# EAGLE design communications_hub2 (EAGLE 9.2.2)
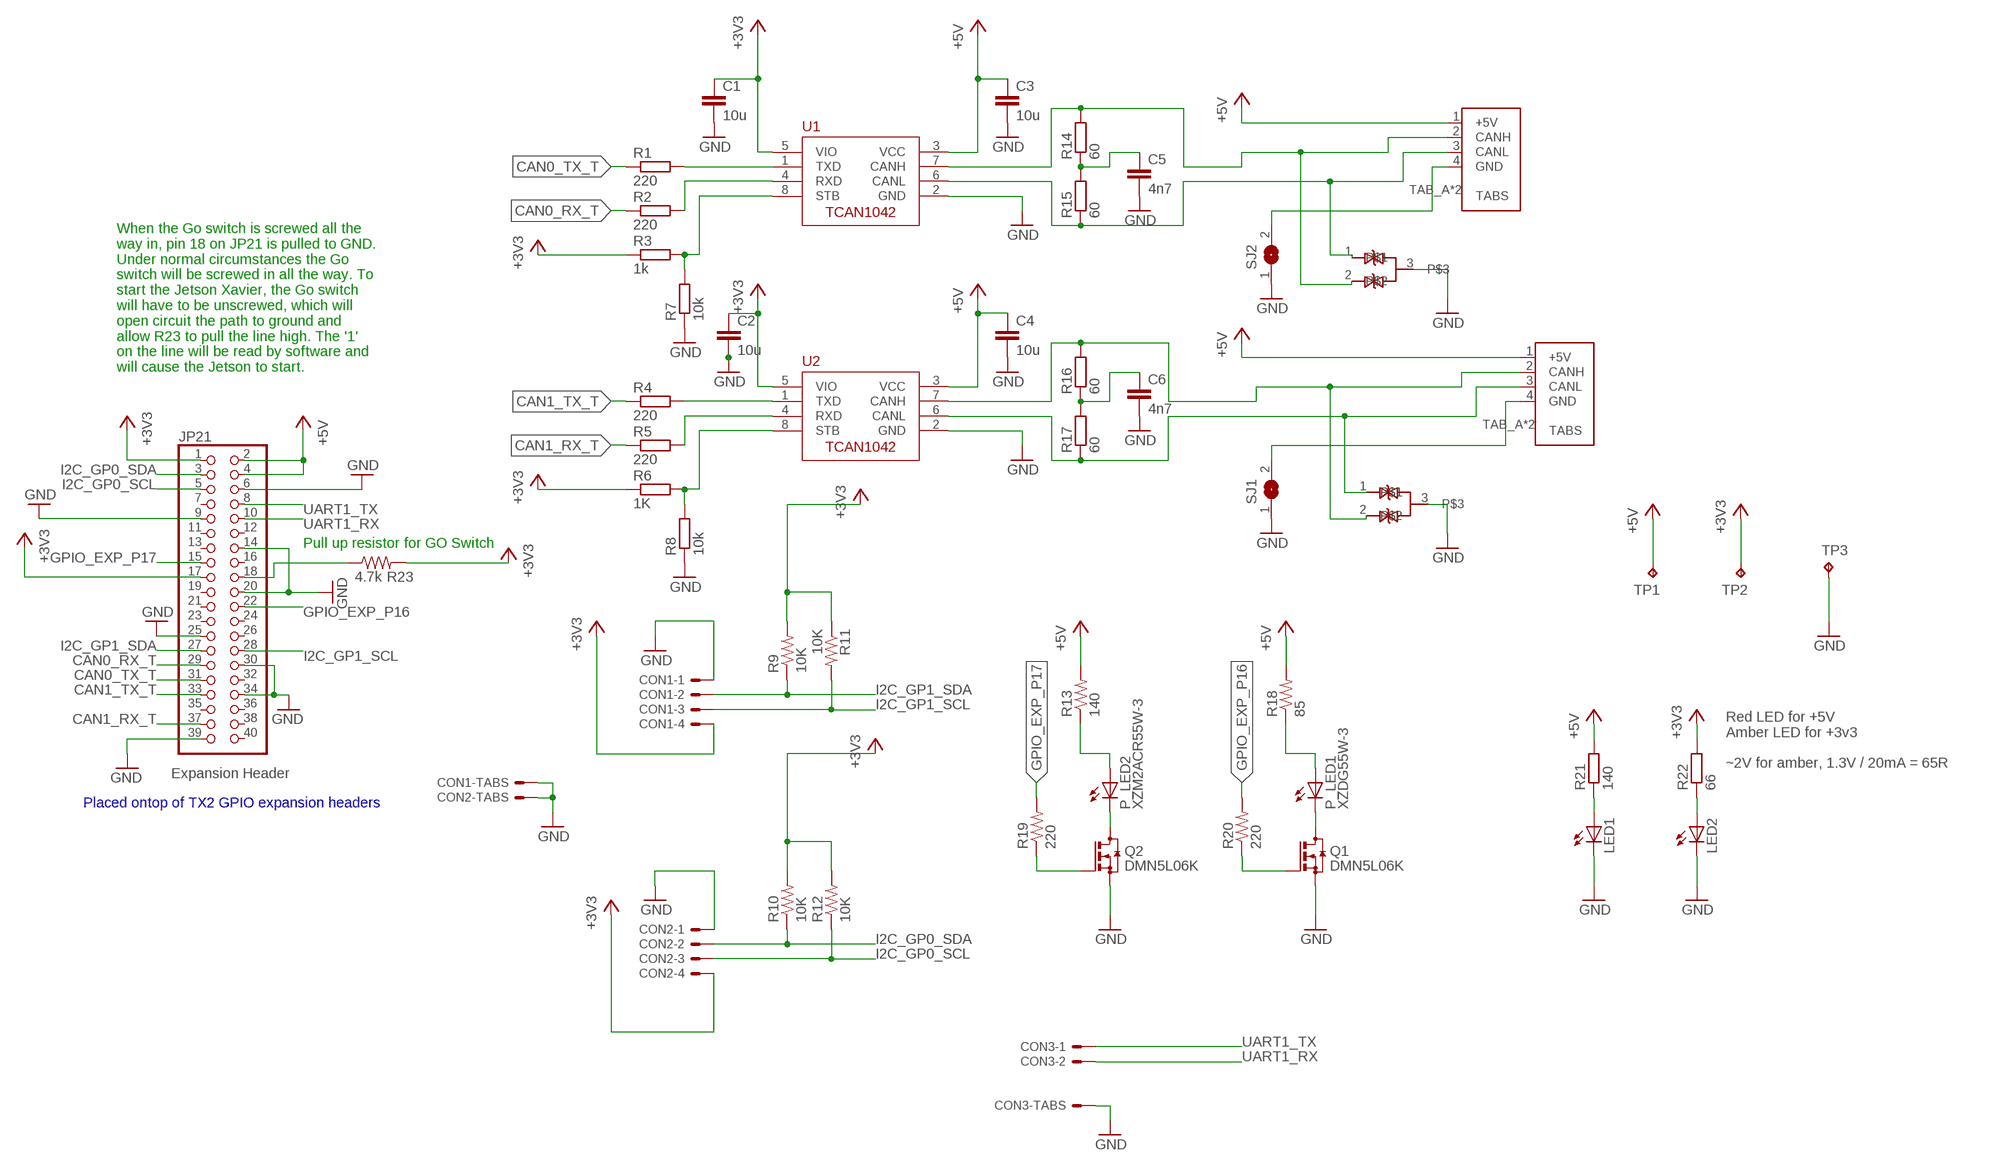
[diagram p0: schematic, sheet 1]

## Parts
C1  10u  C-EUC0805  [C0805]
C2  10u  C-EUC0805  [C0805]
C3  10u  C-EUC0805  [C0805]
C4  10u  C-EUC0805  [C0805]
C5  4n7  C-EUC0805  [C0805]
C6  4n7  C-EUC0805  [C0805]
CON1  SM04B-GHS-TB  [SM04B-GHS-TB]
CON2  SM04B-GHS-TB  [SM04B-GHS-TB]
CON3  SM02B-GHS-TB  [SM02B-GHS-TB]
CON6  UAVCAN_MICRO  [SM04B-GHS-TB]
CON7  UAVCAN_MICRO  [SM04B-GHS-TB]
JP21  PINHD-2X20  [2X20]
LED1  LEDSMT1206  [1206]
LED2  LEDSMT1206  [1206]
P_LED1  XZDG55W-3  LED_E  [LED_1206]
P_LED2  XZM2ACR55W-3  LED_E  [LED_1206]
Q1  DMN5L06K  BSS123  [SOT23]
Q2  DMN5L06K  BSS123  [SOT23]
R1  220  R-EU_R0805  [R0805]
R2  220  R-EU_R0805  [R0805]
R3  1k  R-EU_R0805  [R0805]
R4  220  R-EU_R0805  [R0805]
R5  220  R-EU_R0805  [R0805]
R6  1K  R-EU_R0805  [R0805]
R7  10k  R-EU_R0805  [R0805]
R8  10k  R-EU_R0805  [R0805]
R9  10K  R-US_M1206  [M1206]
R10  10K  R-US_M1206  [M1206]
R11  10K  R-US_M1206  [M1206]
R12  10K  R-US_M1206  [M1206]
R13  140  R-US_M1206  [M1206]
R14  60  R-EU_R1206  [R1206]
R15  60  R-EU_R1206  [R1206]
R16  60  R-EU_R1206  [R1206]
R17  60  R-EU_R1206  [R1206]
R18  85  R-US_M1206  [M1206]
R19  220  R-US_R0805  [R0805]
R20  220  R-US_R0805  [R0805]
R21  140  R-EU_R0805  [R0805]
R22  66  R-EU_R0805  [R0805]
R23  4.7k  R-US_R0603  [R0603]
SJ1  SJ  [SJ]
SJ2  SJ  [SJ]
TP1  TPB2,54  [B2,54]
TP2  TPB2,54  [B2,54]
TP3  TPB2,54  [B2,54]
U1  TCAN1042HVDR  [SO-8]
U2  TCAN1042HVDR  [SO-8]
U$4  NUP2105L  [SOT23]
U$5  NUP2105L  [SOT23]

## Nets
+3V3: C1.1 C2.1 CON1.P$4 CON2.P$4 JP21.1 JP21.17 R3.1 R6.1 R9.2 R10.2 R11.1 R12.2 R22.2 R23.2 TP2.TP U1.5(VIO) U2.5(VIO)
+5V: C3.1 C4.1 CON6.1(+5V) CON7.1(+5V) JP21.2 JP21.4 R13.2 R18.2 R21.2 TP1.TP U1.3(VCC) U2.3(VCC)
CAN0_RX_T: JP21.29 R2.1
CAN0_TX_T: JP21.31 R1.1
CAN1_RX_T: JP21.37 R5.1
CAN1_TX_T: JP21.33 R4.1
GND: C1.2 C2.2 C3.2 C4.2 C5.2 C6.2 CON1.P$1 CON1.P$5 CON1.P$6 CON2.P$1 CON2.P$5 CON2.P$6 CON3.P$3 CON3.P$4 JP21.6 JP21.9 JP21.14 JP21.20 JP21.25 JP21.30 JP21.34 JP21.39 LED1.C LED2.C Q1.2(S) Q2.2(S) R7.1 R8.1 SJ1.1 SJ2.1 TP3.TP U1.2(GND) U2.2(GND) U$4.3 U$5.3
GPIO_EXP_P16: JP21.22 R20.2
GPIO_EXP_P17: JP21.15 R19.2
I2C_GP0_SCL: CON2.P$3 JP21.5 R12.1
I2C_GP0_SDA: CON2.P$2 JP21.3 R10.1
I2C_GP1_SCL: CON1.P$3 JP21.28 R11.2
I2C_GP1_SDA: CON1.P$2 JP21.27 R9.1
N$1: JP21.18 R23.1
N$3: P_LED2.A R13.1
N$4: P_LED1.A R18.1
N$7: CON7.4(GND) SJ1.2
N$8: CON6.4(GND) SJ2.2
N$9: P_LED2.C Q2.3(D)
N$10: P_LED1.C Q1.3(D)
N$11: Q2.1(G) R19.1
N$12: Q1.1(G) R20.1
N$13: LED1.A R21.1
N$14: LED2.A R22.1
N$19: C5.1 R14.1 R15.2
N$20: C6.1 R16.1 R17.2
N$21: CON7.2(CANH) R16.2 U2.7(CANH) U$5.2
N$22: CON7.3(CANL) R17.1 U2.6(CANL) U$5.1
N$23: CON6.2(CANH) R14.2 U1.7(CANH) U$4.2
N$24: CON6.3(CANL) R15.1 U1.6(CANL) U$4.1
N$25: R1.2 U1.1(TXD)
N$26: R2.2 U1.4(RXD)
N$27: R3.2 R7.2 U1.8(STB)
N$28: R4.2 U2.1(TXD)
N$29: R5.2 U2.4(RXD)
N$30: R6.2 R8.2 U2.8(STB)
UART1_RX: CON3.P$2 JP21.10
UART1_TX: CON3.P$1 JP21.8
Unconnected: CON6.TAB_A(TABS) CON6.TAB_B(TABS) CON7.TAB_A(TABS) CON7.TAB_B(TABS) JP21.7 JP21.11 JP21.12 JP21.13 JP21.16 JP21.19 JP21.21 JP21.23 JP21.24 JP21.26 JP21.32 JP21.35 JP21.36 JP21.38 JP21.40

## Notes on the sheet
- When the Go switch is screwed all the
   way in, pin 18 on JP21 is pulled to GND.
   Under normal circumstances the Go
   switch will be screwed in all the way. To
   start the Jetson Xavier, the Go switch
   will have to be unscrewed, which will
   open circuit the path to ground and
   allow R23 to pull the line high. The '1'
   on the line will be read by software and
   will cause the Jetson to start.
- Pull up resistor for GO Switch
- Expansion Header
- Red LED for +5V
  Amber LED for +3v3
  
  ~2V for amber, 1.3V / 20mA = 65R
- Placed ontop of TX2 GPIO expansion headers

## Library data of the parts
C1-C6 = resistor:C-EU: CAPACITOR, European symbol
CON1 CON2 = ARVP:SM04B-GHS-TB
CON3 = ARVP:SM02B-GHS-TB
CON6 CON7 = SPEAR-general:UAVCAN_MICRO: CAN Bus Standard Connector
JP21 = commhub:PINHD-2X20: PIN HEADER
LED1 LED2 = led:LED: LED OSRAM: - CHIPLED LG R971, LG N971, LY N971, LG Q971, LY Q971, LO R971, LY R971 LH N974, LH R974 LS Q976, LO Q976, LY Q976 LO Q996 - Hyper CHIPLED LW Q18S LB Q993, LB Q99A, LB R99A - SideLED LS A670, LO A670, LY A670, LG A670, LP A670 LB A673, LV A673, LT A673, LW A673 LH A674 LY A675 LS A676, LA A676, LO A676, LY A676, LW A676 LS A679, LY A679, LG A679 - Hyper Micro SIDELED® LS Y876, LA Y876, LO Y876, LY Y876 LT Y87S - SmartLED LW L88C, LW L88S LB L89C, LB L89S, LG L890 LS L89K, LO L89K, LY L89K LS L896, LA L896, LO L896, LY L896 - TOPLED LS T670, LO T670, LY T670, LG T670, LP T670 LSG T670, LSP T670, LSY T670, LOP T670, LYG T670 LG T671, LOG T671, LSG T671 LB T673, LV T673, LT T673, LW T673 LH T674 LS T676, LA T676, LO T676, LY T676, LB T676, LH T676, LSB T676, LW T676 LB T67C, LV T67C, LT T67C, LS T67K, LO T67K, LY T67K, LW E67C LS E67B, LA E67B, LO E67B, LY E67B, LB E67C, LV E67C, LT E67C LW T67C LS T679, LY T679, LG T679 LS T770, LO T770, LY T770, LG T770, LP T770 LB T773, LV T773, LT T773, LW T773 LH T774 LS E675, LA E675, LY E675, LS T675 LS T776, LA T776, LO T776, LY T776, LB T776 LHGB T686 LT T68C, LB T68C - Hyper Mini TOPLED® LB M676 - Mini TOPLED Santana® LG M470 LS M47K, LO M47K, LY M47K Source: http://www.osram.convergy.de LUXEON: - LUMILED® LXK2-PW12-R00, LXK2-PW12-S00, LXK2-PW14-U00, LXK2-PW14-V00 LXK2-PM12-R00, LXK2-PM12-S00, LXK2-PM14-U00 LXK2-PE12-Q00, LXK2-PE12-R00, LXK2-PE12-S00, LXK2-PE14-T00, LXK2-PE14-U00 LXK2-PB12-K00, LXK2-PB12-L00, LXK2-PB12-M00, LXK2-PB14-N00, LXK2-PB14-P00, LXK2-PB14-Q00 LXK2-PR12-L00, LXK2-PR12-M00, LXK2-PR14-Q00, LXK2-PR14-R00 LXK2-PD12-Q00, LXK2-PD12-R00, LXK2-PD12-S00 LXK2-PH12-R00, LXK2-PH12-S00 LXK2-PL12-P00, LXK2-PL12-Q00, LXK2-PL12-R00 Source: www.luxeon.com KINGBRIGHT: KA-3528ASYC Source: www.kingbright.com
P_LED1 P_LED2 = eagle-ltspice:LED_E: LED Source: http://www.osram.convergy.de Source: www.luxeon.com Source: www.kingbright.com; SPICEMODEL: NONE; SPICEPREFIX: D; SPICETYPE: diode
Q1 Q2 = transistor-small-signal:BSS123: N-CHANNEL MOS FET
R1-R8 R14-R17 R21 R22 = resistor:R-EU_: RESISTOR, European symbol
R9-R13 R18 = resistor:R-US_: RESISTOR, American symbol
R19 R20 = rcl:R-US_: RESISTOR, American symbol
R23 = audio amplifier example:R-US_: RESISTOR, American symbol
SJ1 SJ2 = jumper:SJ: SMD solder JUMPER
TP1-TP3 = testpad:TP: Test pad
U1 U2 = ARVP:TCAN1042HVDR
U$4 U$5 = ARVP:NUP2105L

## Board
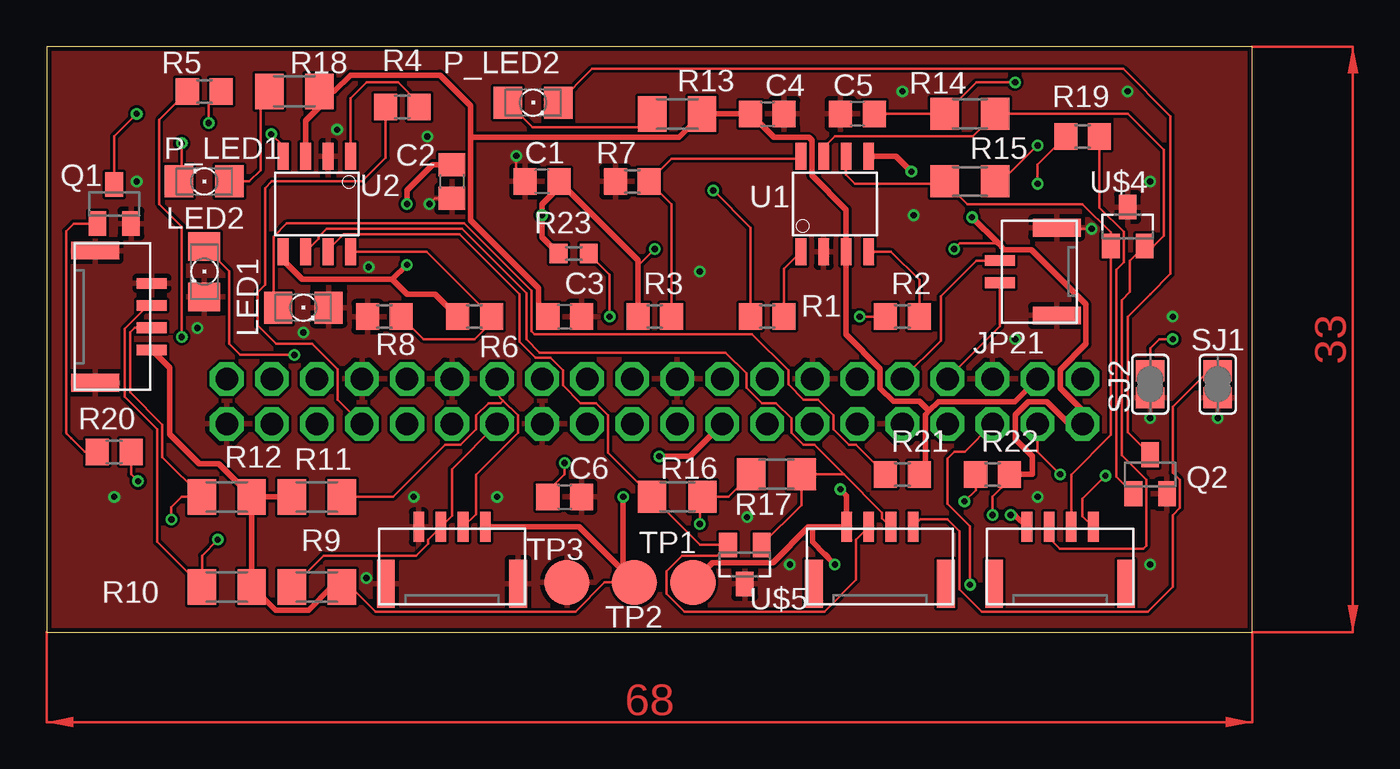
[diagram p1: board, top side]
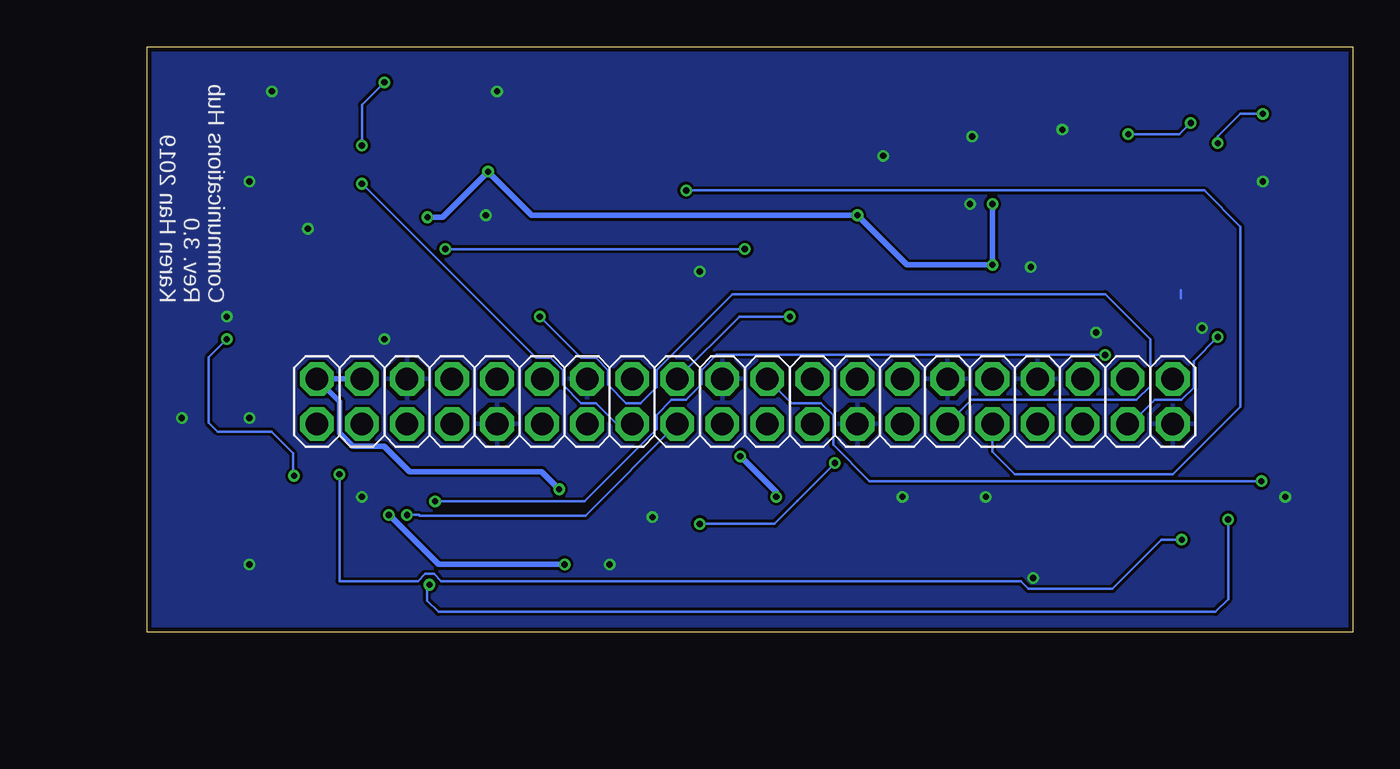
[diagram p2: board, bottom side, seen from below]

Size 68 x 33 mm. Coordinates in mm from the lower left corner, seen from the top.
Outline: 0,0 68,0 68,33 0,33 0,0
Copper layers (1*16): Top 0.035mm / dielectric 1.5mm / Bottom 0.035mm
Design rules "JLCPCB2Layer": minimum track width 6mil, minimum drill 10mil, track to track 6mil, track to pad 6mil, pad to pad 6mil, via to via 6mil, smd to smd 0mil, copper to edge 10mil, drill to drill 10mil, minimum pad ring 6mil, minimum via ring 6mil, stop-mask expansion 2mil, vias tented up to drill 100mil, thermal gap 10mil

### Footprints (pad centres in the part's own frame; a part is rotated, then mirrored left to right if it is on the bottom)
C0805 = smd 1.3 x 1.5: 1 -0.95,0; 2 0.95,0
SM04B-GHS-TB = smd 0.6 x 1.7: P$1 -1.875,0.85; P$2 -0.625,0.85; P$3 0.625,0.85; P$4 1.875,0.85 | smd 1 x 2.7: P$5 -3.725,-2.35; P$6 3.725,-2.35
SM02B-GHS-TB = smd 0.6 x 1.7: P$1 -0.625,0.85; P$2 0.625,0.85 | smd 1 x 2.7: P$3 -2.475,-2.35; P$4 2.475,-2.35
SM04B-GHS-TB' = smd 0.6 x 1.7: 1 -1.875,0.85; 2 -0.625,0.85; 3 0.625,0.85; 4 1.875,0.85 | smd 1 x 2.7: TAB_A -3.725,-2.35; TAB_B 3.725,-2.35
2X20 = drill 1.27 octagon: 1 -24.13,-1.27; 2 -24.13,1.27; 3 -21.59,-1.27; 4 -21.59,1.27; 5 -19.05,-1.27; 6 -19.05,1.27; 7 -16.51,-1.27; 8 -16.51,1.27; 9 -13.97,-1.27; 10 -13.97,1.27; 11 -11.43,-1.27; 12 -11.43,1.27; 13 -8.89,-1.27; 14 -8.89,1.27; 15 -6.35,-1.27; 16 -6.35,1.27; 17 -3.81,-1.27; 18 -3.81,1.27; 19 -1.27,-1.27; 20 -1.27,1.27; 21 1.27,-1.27; 22 1.27,1.27; 23 3.81,-1.27; 24 3.81,1.27; 25 6.35,-1.27; 26 6.35,1.27; 27 8.89,-1.27; 28 8.89,1.27; 29 11.43,-1.27; 30 11.43,1.27; 31 13.97,-1.27; 32 13.97,1.27; 33 16.51,-1.27; 34 16.51,1.27; 35 19.05,-1.27; 36 19.05,1.27; 37 21.59,-1.27; 38 21.59,1.27; 39 24.13,-1.27; 40 24.13,1.27
1206 = smd 1.6 x 1.803: A -1.422,0; C 1.422,0
LED_1206 = smd 1.6 x 1.803: A -1.422,0; C 1.422,0
SOT23 = smd 1 x 1.4: 1 -0.95,-1.1; 2 0.95,-1.1; 3 0,1.1
R0805 = smd 1.3 x 1.5: 1 -0.95,0; 2 0.95,0
M1206 = smd 1.6 x 2: 1 -1.4,0; 2 1.4,0
R1206 = smd 1.6 x 1.803: 1 -1.422,0; 2 1.422,0
R0603 = smd 1 x 1.1: 1 -0.85,0; 2 0.85,0
SJ = smd 1.168 x 1.6: 1 -0.762,0; 2 0.762,0
B2,54 = smd 2.54 x 2.54: TP 0,0
SO-8 = smd 1.524 x 0.61: 1 -2.692,1.905; 2 -2.692,0.635; 3 -2.692,-0.635; 4 -2.692,-1.905; 5 2.692,-1.905; 6 2.692,-0.635; 7 2.692,0.635; 8 2.692,1.905

### Placement (x,y rotation side)
C1  27.94,25.4 180 top
C2  22.86,25.4 270 top
C3  29.21,17.78 0 top
C4  40.64,29.21 0 top
C5  45.72,29.21 180 top
C6  29.21,7.62 0 top
CON1  22.86,5.08 0 top
CON2  5.08,17.78 270 top
CON3  54.61,20.32 90 top
CON6  UAVCAN_MICRO  [SM04B-GHS-TB']  57.15,5.08 0 top
CON7  UAVCAN_MICRO  [SM04B-GHS-TB']  46.99,5.08 0 top
JP21  34.29,13 0 bottom
LED1  14.48,18.29 0 top
LED2  8.89,20.32 270 top
P_LED1  8.89,25.4 180 top
P_LED2  27.43,29.84 0 top
Q1  3.81,24.13 0 top
Q2  62.23,8.89 0 top
R1  40.64,17.78 0 top
R2  48.26,17.78 0 top
R3  34.29,17.78 0 top
R4  20.07,29.59 0 top
R5  8.89,30.48 0 top
R6  24.13,17.78 0 top
R7  33.02,25.4 0 top
R8  19.05,17.78 0 top
R9  15.24,2.54 0 top
R10  10.16,2.54 0 top
R11  15.24,7.62 0 top
R12  10.16,7.62 0 top
R13  35.56,29.21 0 top
R14  52.07,29.21 0 top
R15  52.07,25.4 0 top
R16  35.56,7.62 180 top
R17  41.15,8.89 180 top
R18  13.97,30.48 0 top
R19  58.42,27.94 180 top
R20  3.81,10.16 0 top
R21  48.26,8.89 0 top
R22  53.34,8.89 0 top
R23  29.72,21.34 180 top
SJ1  66.04,13.97 90 top
SJ2  62.23,13.97 90 top
TP1  36.45,2.79 0 top
TP2  33.15,2.79 0 top
TP3  29.34,2.79 0 top
U1  44.45,24.13 90 top
U2  15.24,24.13 270 top
U$4  60.96,22.86 0 top
U$5  39.37,3.81 180 top

### Tracks (layer width: path | path; a pad name or v marks a point on that pad's centre or on a via)
+3V3  (via drill 0.35)
  Top 0.152: R3.1 33.34,20.64 v34.29,21.59 | v51.18,21.59 51.5,21.91 53.66,21.91 | R22.2 54.29,8.57 53.34,7.62 v53.34,6.6 | R9.2 17.15,2.54 18.54,1.15 29.81,1.15 31.46,2.79 TP2.TP
  Top 0.305: U2.5 13.34,20.95 14.41,19.88 19.49,19.88 | CON2.P$4 6.93,14.9 6.93,11.15 8.61,9.47 9.71,9.47 R12.2 | R12.2 R11.1 | CON1.P$4 30.01,5.93 TP2.TP 32.51,3.43 v32.51,7.62 | R12.2 R10.2 11.61,2.54 12.91,1.24 14.77,1.24 16.07,2.54 R9.2 | R3.1 33.34,20.95 C1.1 28.89,25.08 27.94,24.13 v27.94,23.5 27.94,22.26 R23.2 | R22.2 55.58,8.89 55.58,9.92 54.62,10.88 54.62,12.25 55.36,12.99 56.4,12.99 57.66,11.73 JP21.1 58.42,12.49 57.16,13.75 57.16,14.79 58.62,16.24 58.62,18.47 55.54,21.55 54.02,21.55 53.66,21.91 v52.19,23.38 | JP21.17 36.28,9.91 v34.54,9.91 | v20.32,24.13 20.32,24.89 21.78,26.35 C2.1 | v20.32,20.7 19.49,19.88 | 19.49,19.88 | U1.5 47.9,26.82 v48.77,25.96 | 19.49,19.88 20.32,19.05 21.91,19.05 R6.1
  Bottom 0.152: v34.29,21.59 v51.18,21.59 | v53.34,6.6 52.67,6.6 52.62,6.56 43.27,6.56 JP21.17
  Bottom 0.305: v20.32,24.13 v20.32,20.7 25.15,20.7 v27.94,23.5 31.75,23.5 46.31,23.5 v48.77,25.96 51.34,23.38 v52.19,23.38 | v34.54,9.91 32.51,7.87 v32.51,7.62
+5V  (via drill 0.35)
  Top 0.305: U2.3 14.61,28.83 15.37,29.59 R18.2 16.23,30.48 17.14,31.4 22.18,31.4 23.91,29.67 23.91,27.91 | TP1.TP 37.56,3.9 40.95,3.9 42.97,5.93 43.18,5.93 | 43.18,5.93 CON7.1 45.12,7.69 v44.76,8.05 | C3.1 27.74,18.3 27.74,19.38 23.91,23.21 23.91,27.91 | 49.76,12.47 49.54,12.25 49.54,9.22 R21.2 | 49.76,12.47 50.28,12.99 54.6,12.99 JP21.4 | CON6.1 54.61,6.59 54.61,6.6 v54.36,6.6 | 43.18,5.93 43.18,5.08 43.88,4.38 43.89,4.38 44.07,4.21 44.07,4.19 v44.45,3.81 | 23.91,27.91 35.66,27.91 R13.2 C4.1 41.01,27.89 42.98,27.89 43.16,27.71 43.16,25.75 45.09,23.82 U1.3 45.09,16.77 47,14.86 47,13.75 47.74,13.01 49.22,13.01 49.76,12.47
  Bottom 0.305: v54.36,6.6 51.56,3.81 v44.45,3.81 | JP21.4 JP21.2 57.14,12.99 57.14,11.21 56.4,10.47 54.62,10.47 53.19,9.04 45.75,9.04 v44.76,8.05
CAN0_RX_T  (via drill 0.35)
  Top 0.152: R2.1 v45.85,17.78
  Bottom 0.152: v45.85,17.78 43.52,15.45 42.69,15.45 42,14.76 42,13.93 40.98,12.91 40.16,12.91 39.28,13.79 39.28,14.76 34.99,19.05 13.97,19.05 11.43,16.51 11.43,13.87 12.21,13.09 21.5,13.09 JP21.29
CAN0_TX_T  (via drill 0.35)
  Top 0.152: R1.1 39.69,22.79 v37.59,24.89
  Bottom 0.152: v37.59,24.89 8.38,24.89 6.35,22.86 6.35,12.7 10.16,8.89 19.05,8.89 20.32,10.16 JP21.31
CAN1_RX_T  (via drill 0.35)
  Top 0.152: R5.1 6.35,28.89 6.35,24.13 7.62,22.86 v7.62,16.64
  Bottom 0.152: JP21.37 12.53,11.73 11.17,13.09 9.67,13.09 8.98,13.78 8.98,15.28 v7.62,16.64
CAN1_TX_T
  Top 0.152: R4.1 19.12,26.74 17.78,25.4 12.7,25.4 12.32,25.02 12.32,19.58 11.9,19.16 11.9,17.29 12.94,16.26 14.99,16.26 16.42,14.82 16.42,13.09 JP21.33
GND  (via drill 0.35)
  Top 0.152: SJ1.1 v66.04,12.06 | v58.93,22.73 57.02,22.73 CON3.P$4 | C2.2 22.86,24.46 | C2.2 22.8,24.39 22.86,24.34 22.86,24.08 | v26.48,26.84 26.48,25.91 C1.2 | C2.2 21.91,24.45 v21.59,24.13
  Bottom 0.152: 9.71,18.82 9.71,19.28
  other vias: 54.61,16.51 63.5,17.78 36.83,20.32 62.23,3.81 55.88,7.62 5.08,25.4 18.16,20.57 41.91,3.81 25.4,7.62 20.7,7.62 3.81,7.62 16.38,28.32 48.9,23.5 60.96,30.48 48.26,30.48 18.03,3.05 39.5,6.48 62.23,25.4 21.46,27.94 8.51,17.14 14.48,16.89 62.23,12.06
  pour Top: 0,33.02 0,0 67.94,0 67.94,32.89 0.13,32.89
  pour Bottom: 0,33.02 0,0 67.94,0 67.94,33.02
GPIO_EXP_P16  (via drill 0.35)
  Top 0.152: R20.2 4.76,8.89 5.14,8.51 v5.16,8.51
  Bottom 0.152: v5.16,8.51 27.26,8.51 29.3,10.55 29.3,12.22 29.99,12.91 31.66,12.91 JP21.22
GPIO_EXP_P17  (via drill 0.35)
  Top 0.152: R19.2 55.88,26.35 v55.88,25.27
  Bottom 0.152: v55.88,25.27 46.06,15.45 45.23,15.45 44.54,14.76 44.54,13.93 43.52,12.91 42.69,12.91 41.51,11.73 JP21.15
I2C_GP0_SCL  (via drill 0.35)
  Top 0.152: CON2.P$3 4.96,17.16 4.7,16.89 4.7,13.51 6.53,11.68 6.53,9.85 R12.1 7.62,7.62 7.03,7.03 v7.03,6.35 | v52.07,2.67 52.07,5.97 50.8,7.24 50.8,9.78 51.18,10.16 51.77,10.16 JP21.5
  Bottom 0.152: v52.07,2.67 52.2,2.67 52.2,1.78 51.56,1.14 7.75,1.14 7.03,1.86 v7.03,6.35
I2C_GP0_SDA  (via drill 0.35)
  Top 0.152: CON2.P$2 5.71,18.41 5.71,18.4 4.39,17.09 4.39,13.26 6.22,11.43 6.22,5.08 R10.1 8.76,4.32 v9.65,5.21 | v57.15,8.89 55.88,10.16 JP21.3
  Bottom 0.152: v57.15,8.89 57.15,2.87 52.73,2.87 52.32,3.27 51.82,3.27 51.41,2.87 18.71,2.87 18.29,2.44 13.56,2.44 10.79,5.21 v9.65,5.21
I2C_GP1_SCL
  Top 0.152: CON1.P$3 24.21,6.65 24.21,8.87 26.58,11.24 26.58,12.22 25.75,13.05 | JP21.28 25.4,13.4 25.75,13.05 | 25.75,13.05 25.61,12.91 24.91,12.91 24.22,12.22 24.22,11.42 23.35,10.55 22.46,10.55 19.53,7.62 R11.2
I2C_GP1_SDA
  Top 0.152: JP21.27 22.86,9.19 22.86,6.55 CON1.P$2 21.51,5.21 21.51,4.99 20.84,4.31 15.61,4.31 R9.1
N$1  (via drill 0.35)
  Top 0.152: R23.1 31.75,20.15 v31.75,17.78
  Bottom 0.152: v31.75,17.78 34.59,17.78 JP21.18
N$3
  Top 0.152: P_LED2.A 27.41,28.45 33.4,28.45 R13.1
N$4
  Top 0.152: R18.1 12.06,29.97 12.06,26.03 11.43,25.4 P_LED1.A
N$7
  Top 0.152: SJ1.2 65.53,14.73 63.5,12.7 63.5,8.99 63.91,8.59 63.91,7 63.5,6.59 63.5,2.54 62.11,1.15 52.73,1.15 51.46,2.42 51.46,5.69 50.8,6.35 49.28,6.35 CON7.4
N$8  (via drill 0.35)
  Top 0.152: CON6.4 58.42,6.54 58.42,7.53 v59.71,8.81 | v63.5,16.51 62.74,16.51 62.23,16 SJ2.2
  Bottom 0.152: v63.5,16.51 64.52,15.49 64.52,11.81 64.01,11.3 60.98,11.3 59.77,10.08 59.77,8.87 v59.71,8.81
N$9
  Top 0.152: P_LED2.C 30.76,31.75 60.71,31.75 63.37,29.08 63.37,20.19 62.23,19.05 60.96,17.78 60.96,11.26 Q2.3
N$10  (via drill 0.35)
  Top 0.152: Q1.3 3.81,27.94 v5.08,29.21 | v7.62,27.56 7.62,25.55 P_LED1.C
  Bottom 0.152: v5.08,29.21 6.35,29.21 7.62,27.94 v7.62,27.56
N$11
  Top 0.152: R19.1 59.37,23.92 60.74,22.55 60.74,20.86 60.31,20.44 60.31,8.76 Q2.1
N$12
  Top 0.152: R20.1 2.16,10.16 1.4,10.92 1.14,11.18 1.09,11.23 1.09,22.6 1.52,23.03 Q1.1
N$13
  Top 0.152: R21.1 45.65,10.55 45.23,10.55 44.36,11.42 44.36,12.22 43.49,13.09 42.69,13.09 41.82,13.96 41.82,14.76 39.78,16.8 27.52,16.8 27.36,16.96 27.36,19.23 23.54,23.04 13.54,23.04 12.8,22.29 12.8,18.54 LED1.A
N$14  (via drill 0.35)
  Top 0.152: LED2.A 10.29,20.34 10.29,16.26 10.92,15.62 v13.97,15.62 | R22.1 52.39,8 v51.76,7.37
  Bottom 0.152: v51.76,7.37 43.33,7.37 39.28,11.42 39.28,12.22 38.41,13.09 37.61,13.09 36.74,13.96 36.74,14.76 35.88,15.62 v13.97,15.62
N$19  (via drill 0.35)
  Top 0.152: C5.1 R14.1 52.43,30.99 v54.61,30.99 | v55.88,27.43 53.85,25.4 R15.2
  Bottom 0.152: v54.61,30.99 55.88,29.72 v55.88,27.43
N$20  (via drill 0.35)
  Top 0.152: R17.2 38.46,7.62 R16.1 36.83,7.47 v36.83,6.1 | C6.1 28.26,7.94 29.21,8.89 v29.21,9.53
  Bottom 0.152: v29.21,9.53 31.32,7.41 31.32,7.39 32.62,6.1 v36.83,6.1
N$21
  Top 0.152: U2.7 15.88,21.56 16.75,22.43 23.29,22.43 26.67,19.05 26.67,16.36 27.58,15.45 28.43,15.45 29.12,14.76 29.12,13.91 30.12,12.91 30.97,12.91 31.66,12.22 31.66,10.1 R16.2 36.85,4.91 U$5.2 37.8,4.29 35.83,4.29 34.95,3.42 34.95,2.17 35.97,1.15 43.86,1.15 45.64,2.94 45.64,5.21 CON7.2
N$22
  Top 0.152: U2.6 15.34,22.17 15.34,22.29 15.78,22.73 23.42,22.73 27.05,19.1 27.05,16.51 27.8,15.76 38.28,15.76 39.46,14.58 39.46,13.78 40.33,12.91 41.13,12.91 42,12.04 42,11.24 42.69,10.55 43.3,10.55 44.96,8.89 | CON7.3 47.12,6.43 47.12,6.73 44.96,8.89 | 44.96,8.89 R17.1 42.57,7.16 U$5.1
N$23
  Top 0.152: U1.7 43.81,27.3 44.45,27.94 52.22,27.94 R14.2 60.96,29.21 62.99,27.18 62.99,22.35 62.4,21.76 U$4.2 61.09,20.94 61.09,19.18 60.62,18.71 60.62,9.97 62.01,8.59 62.01,4.86 61.85,4.7 57.15,4.7 56.52,5.32 CON6.2
N$24
  Top 0.152: U1.6 45.09,25.78 45.59,25.27 50.52,25.27 R15.1 51.92,24.13 58.42,24.13 60.01,22.54 U$4.1 60.01,11.12 57.77,8.88 CON6.3
N$25
  Top 0.152: R1.2 41.59,20.48 U1.1
N$26
  Top 0.152: R2.2 49.21,19.85 47.62,21.44 U1.4
N$27
  Top 0.152: R3.2 35.24,24.13 R7.2 35.24,26.67 42.39,26.67 U1.8
N$28
  Top 0.152: U2.1 17.14,30.1 18.03,30.99 19.81,30.99 21.02,29.78 R4.2
N$29  (via drill 0.35)
  Top 0.152: R5.2 9.14,29.78 v9.14,28.7 | v12.67,28.07 13.34,27.4 U2.4
  Bottom 0.152: v9.14,28.7 9.78,28.07 v12.67,28.07
N$30
  Top 0.152: U2.8 21.42,21.44 R6.2 25.08,17.46 24.13,16.51 21.27,16.51 R8.2
UART1_RX
  Top 0.152: CON3.P$2 52.44,20.95 50.42,18.92 50.42,16.43 JP21.10
UART1_TX
  Top 0.152: CON3.P$1 53.76,17.23 JP21.8
(copper drawn outside any net)
  shapes: Top area x2

### Text on the board
bNames: Communications Hub / Rev. 3.0 / Karen Han 2019